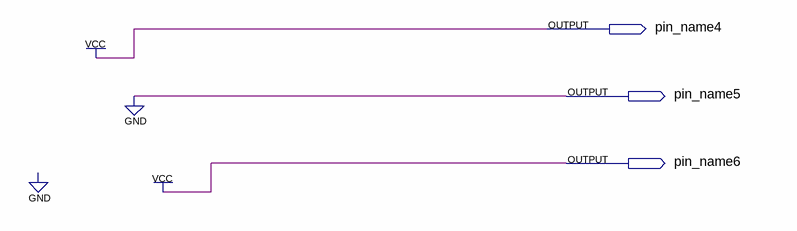
[diagram p0: schematic sheet]
// Quartus schematic block1.bdf as structural Verilog: 0 symbols, 3 pins
module block1 (
  output pin_name4,
  output pin_name5,
  output pin_name6
);


  assign pin_name4 = 1'b1;
  assign pin_name5 = 1'b0;
  assign pin_name6 = 1'b1;
endmodule
